# Altium schematic sheet Fri3D_2026_Power.SchDoc: Power
size A3; Date: 23/05/2025; DrawnBy: Wim Van Gool; DocumentNumber: 4; Revision: 00; SheetNumber: 4; SheetTotal: 4
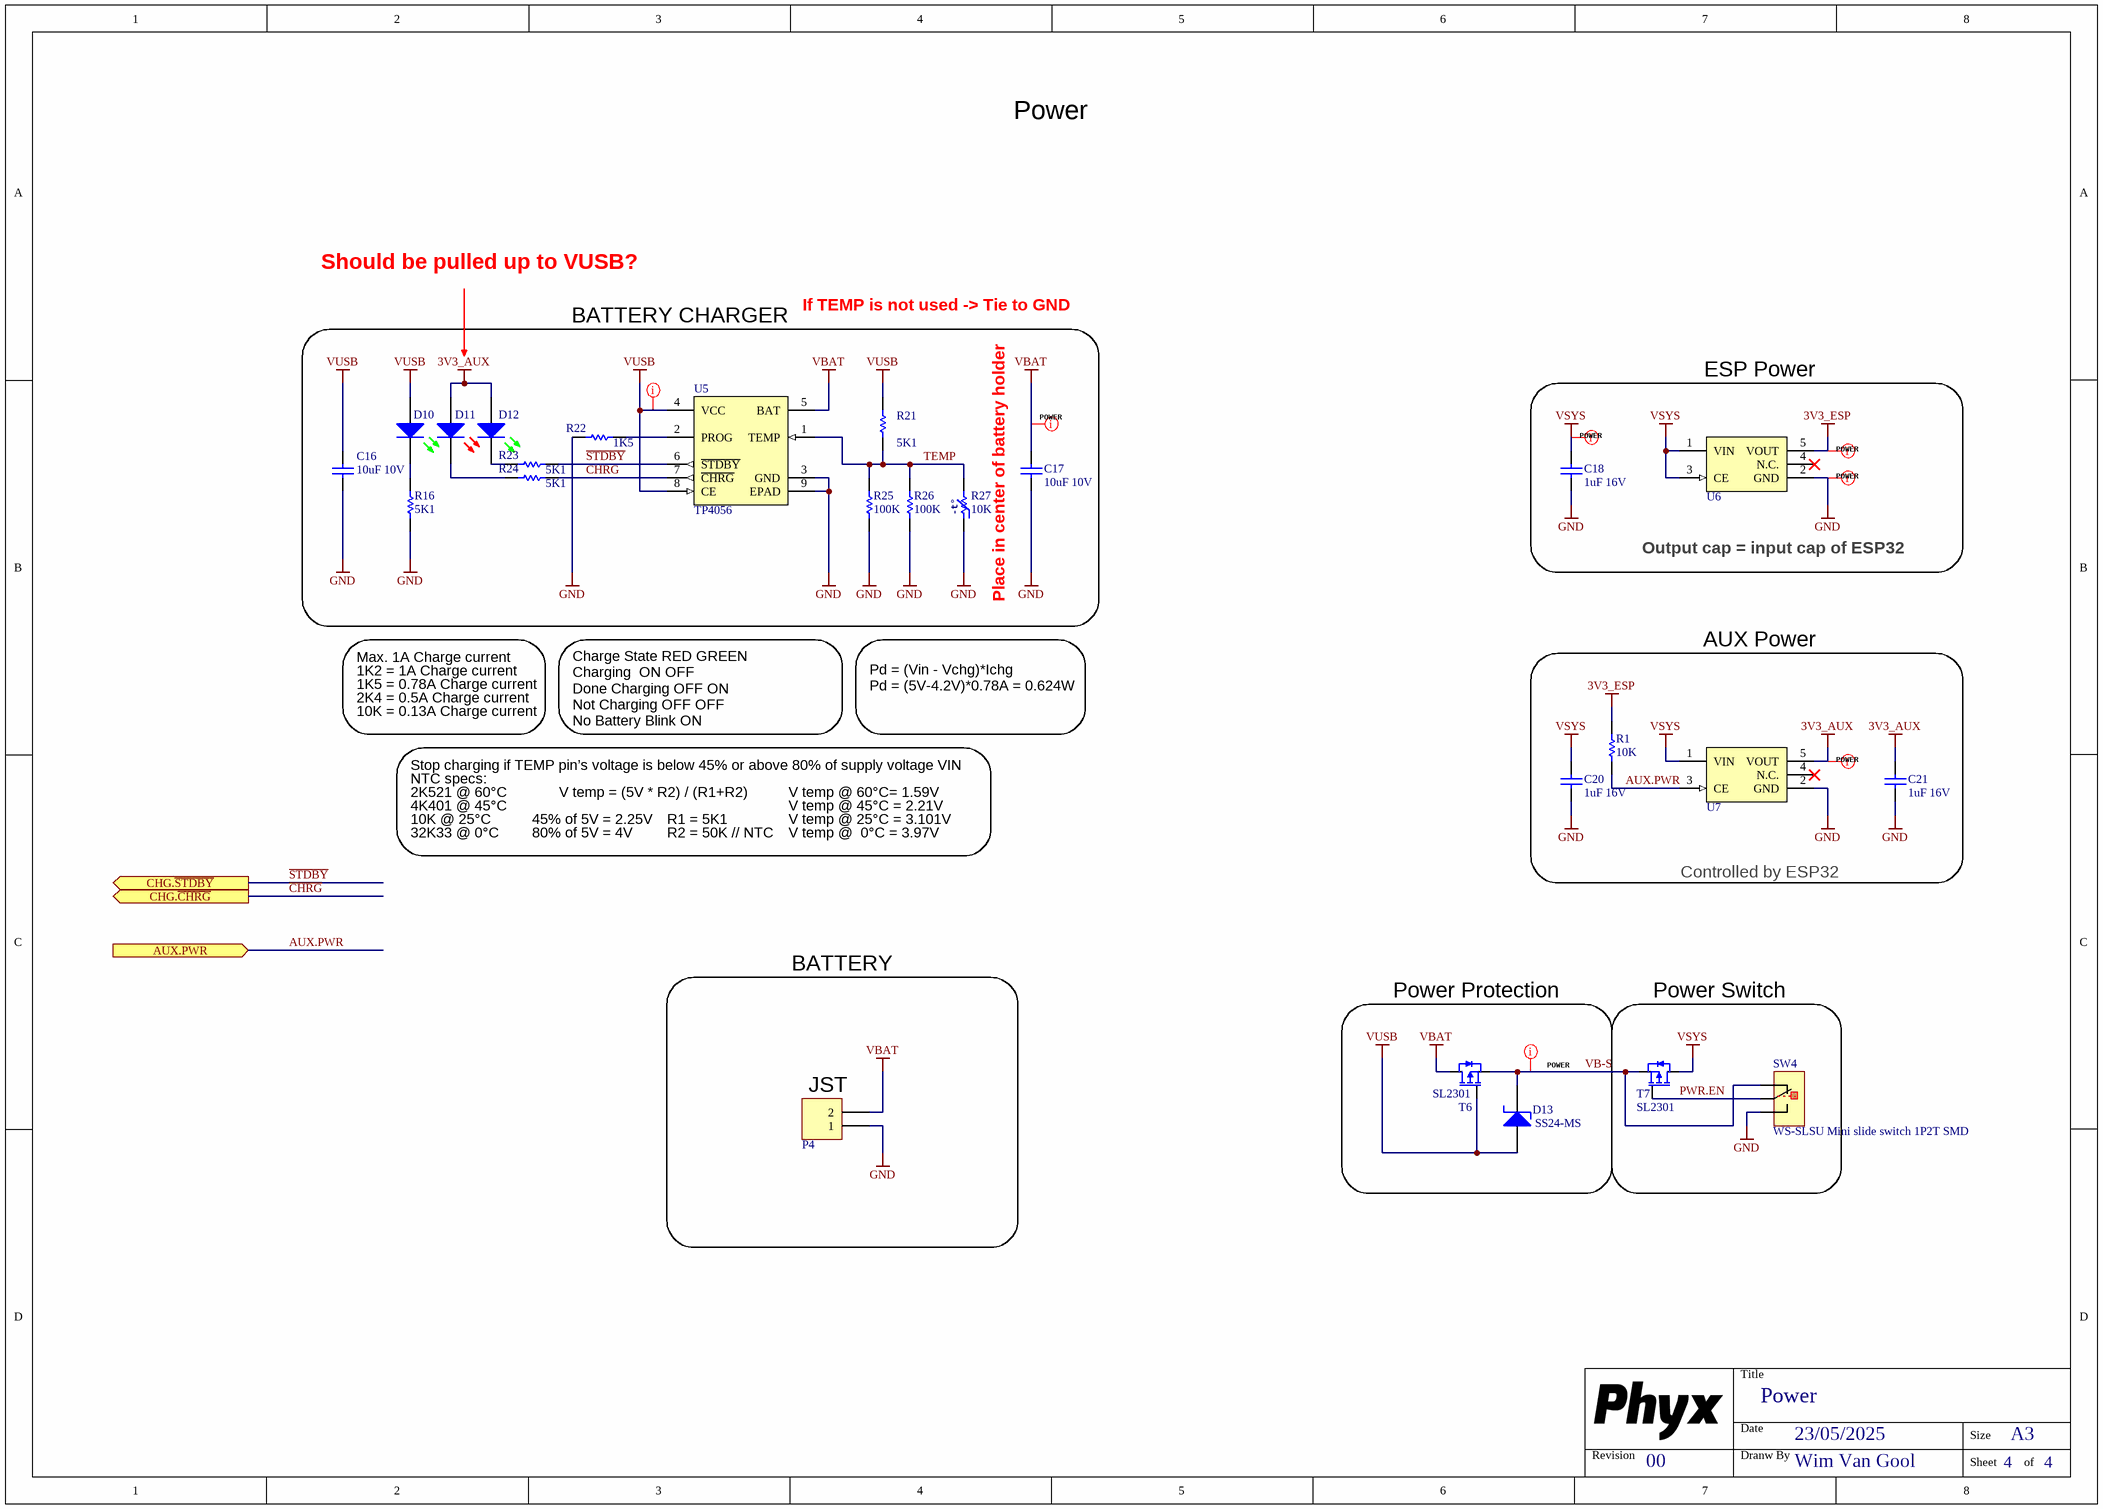
[diagram p0: Fri3D_2026_Power.SchDoc]

## Parts
C16  value 10uF 10V  [C0805_N]
C17  value 10uF 10V  [C0805_N]
C18  value 1uF 16V  [C0603_N]
C20  value 1uF 16V  [C0603_N]
C21  value 1uF 16V  [C0603_N]
D10  Default 0805 Green LED  [LED_0805_GR]  (value not drawn)
D11  Default 0805 Red LED  [LED_0805_RD]  (value not drawn)
D12  Default 0805 Green LED  [LED_0805_GR]  (value not drawn)
D13  value SS24-MS  [DO-214AC_AC]  (hidden comment: 40V 2A 550mV@2A DO-214 Schottky)
P4  Header RA 1.5mm Shrouded S2B-ZR-SM4A-TF  [JST_ZH_S2B-ZR-SM4A-TF]  (value not drawn)
R1  value 10K  [R0603_N]
R16  value 5K1  [R0603_N]
R21  value 5K1  [R0603_N]
R22  value 1K5  [R0603_N]
R23  value 5K1  [R0603_N]
R24  value 5K1  [R0603_N]
R25  value 100K  [R0603_N]
R26  value 100K  [R0603_N]
R27  value 10K  [R0402]
SW4  WS-SLSU Mini slide switch 1P2T SMD  [WE_450404015514]
T6  value SL2301  [SOT23-3]  (hidden comment: -2.3A -20V P-Ch MOSFET Vgs -1V)
T7  value SL2301  [SOT23-3]  (hidden comment: -2.3A -20V P-Ch MOSFET Vgs -1V)
U5  value TP4056  [SOIC_N_8_TH]  (hidden comment: Single Cell LiIon charger max 1A)
U6  3V3 LDO 700mA 50mV  [SOT23-5]  (value not drawn)
U7  3V3 LDO 700mA 50mV  [SOT23-5]  (value not drawn)

## Blocks framed on the sheet
BATTERY CHARGER: C16 C17 D10-D12 R16 R21-R27 U5
ESP Power: C18 U6
AUX Power: C20 C21 R1 U7
Power Protection: D13 T6
Power Switch: SW4 T7

## Ports
AUX.PWR (in), CHG.~{CHRG} (out), CHG.~{STDBY} (out)

## Nets
3V3_AUX: C21.1 D11.1(A) D12.1(A) U7.5(VOUT)
3V3_ESP: R1.1 U6.5(VOUT)
GND: C16.2 C17.2 C18.2 C20.2 C21.2 P4.1 R16.2 R22.2 R25.2 R26.2 R27.2 SW4.3 U5.3(GND) U5.9(EPAD) U6.2(GND) U7.2(GND)
VBAT: C17.1 P4.2 T6.3(D) U5.5(BAT)
VSYS: C18.1 C20.1 T7.3(D) U6.1(VIN) U6.3(CE) U7.1(VIN)
VUSB: C16.1 D10.1(A) D13.A R21.1 T6.1(G) U5.4(VCC) U5.8(CE)
AUX.PWR: R1.2 U7.3(CE) ; port AUX.PWR
~{CHRG}: R24.2 U5.7(~{CHRG}) ; port CHG.~{CHRG}
PWR.EN: SW4.2 T7.1(G)
~{STDBY}: R23.2 U5.6(~{STDBY}) ; port CHG.~{STDBY}
TEMP: R21.2 R25.1 R26.1 R27.1 U5.1(TEMP)
VB-S: D13.C SW4.1 T6.2(S) T7.2(S)
NetD10_2: D10.2(K) R16.1
NetD11_2: D11.2(K) R24.1
NetD12_2: D12.2(K) R23.1
NetR22_1: R22.1 U5.2(PROG)

Not connected (* = marked no-connect by the designer): U6 4(N.C.)*; U7 4(N.C.)*

## Layout directives
net class POWER: 3V3_AUX, 3V3_ESP, GND, VB-S, VBAT, VSYS, VUSB

## Notes on the sheet
- Should be pulled up to VUSB?
- If TEMP is not used -> Tie to GND
- Place in center of battery holder
- Output cap = input cap of ESP32
- 1K2 = 1A Charge current
- 2K4 = 0.5A Charge current
- Max. 1A Charge current
- 10K = 0.13A Charge current
- 1K5 = 0.78A Charge current
- Charge State	RED	GREEN
  Charging		ON	OFF
  Done Charging	OFF	ON
  Not Charging	OFF	OFF
  No Battery	Blink	ON
- Pd = (Vin - Vchg)*Ichg
  Pd = (5V-4.2V)*0.78A = 0.624W
- Stop charging if TEMP pin’s voltage is below 45% or above 80% of supply voltage VIN
- NTC specs:
- 10K @ 25°C
- 32K33 @ 0°C
- 2K521 @ 60°C
- 4K401 @ 45°C
- 45% of 5V = 2.25V
- 80% of 5V = 4V
- V temp = (5V * R2) / (R1+R2)
- R1 = 5K1
- R2 = 50K // NTC
- V temp @ 60°C= 1.59V
- V temp @ 45°C = 2.21V
- V temp @ 25°C = 3.101V
- V temp @  0°C = 3.97V
- Controlled by ESP32
- BATTERY
- (near P4) JST
- Title
- Revision
- Date
- Dranw By
- Size
- A3
- Sheet
- of
- (in symbol NTC # 10K 0402) -t°

## Library data of the parts
C16 C17 = CAP # 10uF 10V 0805: Capacitor Ceramic; Supplier 1: Farnell; Supplier Part Number 1: 2320859; Supplier 2: LCSC; Supplier 3: Generic; Supplier Part Number 2: C17024; Supplier Part Number 3: 10uF 10V 0805 X7R
C18 C20 C21 = CAP # 1uF 16V 0603: Capacitor Ceramic; Supplier 1: Farnell; Supplier Part Number 1: 2320814; Supplier 2: LCSC; Supplier 3: Generic; Supplier Part Number 2: C1592; Supplier Part Number 3: 1uF 16V 0603 X7R
D10 D12 = LED # Green 0805: =Description; Supplier 1: Farnell; Supplier Part Number 1: 2099239; Supplier 2: LCSC; Supplier Part Number 2: C965815
D11 = LED # Red 0805: =Description; Supplier 1: Farnell; Supplier Part Number 1: 2099236; Supplier 2: LCSC; Supplier Part Number 2: C965812
D13 = Schottky # SS24-MS: =Description; Supplier 1: LCSC; Supplier Part Number 1: C2836395
P4 = HDR # RA SHR 1.5mm 2way - S2B-ZR-SM4A-TF: Value: S2B-ZR-SM4A-TF; Supplier 1: LCSC; Supplier Part Number 1: C265329; Supplier 2: Farnell; Supplier Part Number 2: 1830920; Supplier 3: Digi-Key; Supplier Part Number 3: 455-1693-1-ND
R1 = RES # 10K 0603: Supplier 1: Farnell; Supplier Part Number 1: 2502397; Supplier 2: LCSC; Supplier 3: Generic; Supplier Part Number 2: C25804; Supplier Part Number 3: 10K 1% 0603
R16 R21 R23 R24 = RES # 5K1 0603: Supplier 1: Farnell; Supplier Part Number 1: 2845922; Supplier 2: LCSC; Supplier Part Number 2: C112314; Supplier 3: Generic; Supplier Part Number 3: 5K1 1% 0603
R22 = RES # 1K5 0603: Supplier 3: Generic; Supplier Part Number 3: 1K5 1% 0603; Supplier 1: LCSC; Supplier 2: LCSC; Supplier Part Number 1: C2930050; Supplier Part Number 2: C114668
R25 R26 = RES # 100K 0603: Supplier 1: LCSC; Supplier 2: LCSC; Supplier 3: Generic; Supplier Part Number 1: C25803; Supplier Part Number 2: C14675; Supplier Part Number 3: 100K 1% 0603
R27 = NTC # 10K 0402: Supplier 1: LCSC; Supplier Part Number 1: C209959; Supplier 2: LCSC; Supplier Part Number 2: C98099
SW4 = SW # 1P2T WS-SLSU mini slide 6,7 x 2,7 mm: Value: 450404015514; Supplier 1: Digi-key; Supplier 2: LCSC; Supplier Part Number 1: 732-13665-1-ND; Supplier Part Number 2: C431540
T6 T7 = SL2301 P-Ch MOSFET -2.3A -20Vds: =Description; Supplier 1: LCSC; Supplier Part Number 1: C181086
U5 = CHG # TP4056 LiIon 1A: =Description; Supplier 1: Aliexpress; Supplier Part Number 1: TP4056; Supplier 2: LCSC; Supplier Part Number 2: C382139
U6 U7 = LDO # 3V3 XC6210B33: =Designator; Value: XC6210B332MR; Supplier 1: Farnell; Supplier Part Number 1: 1057803; Supplier 2: LCSC; Supplier Part Number 2: C47719